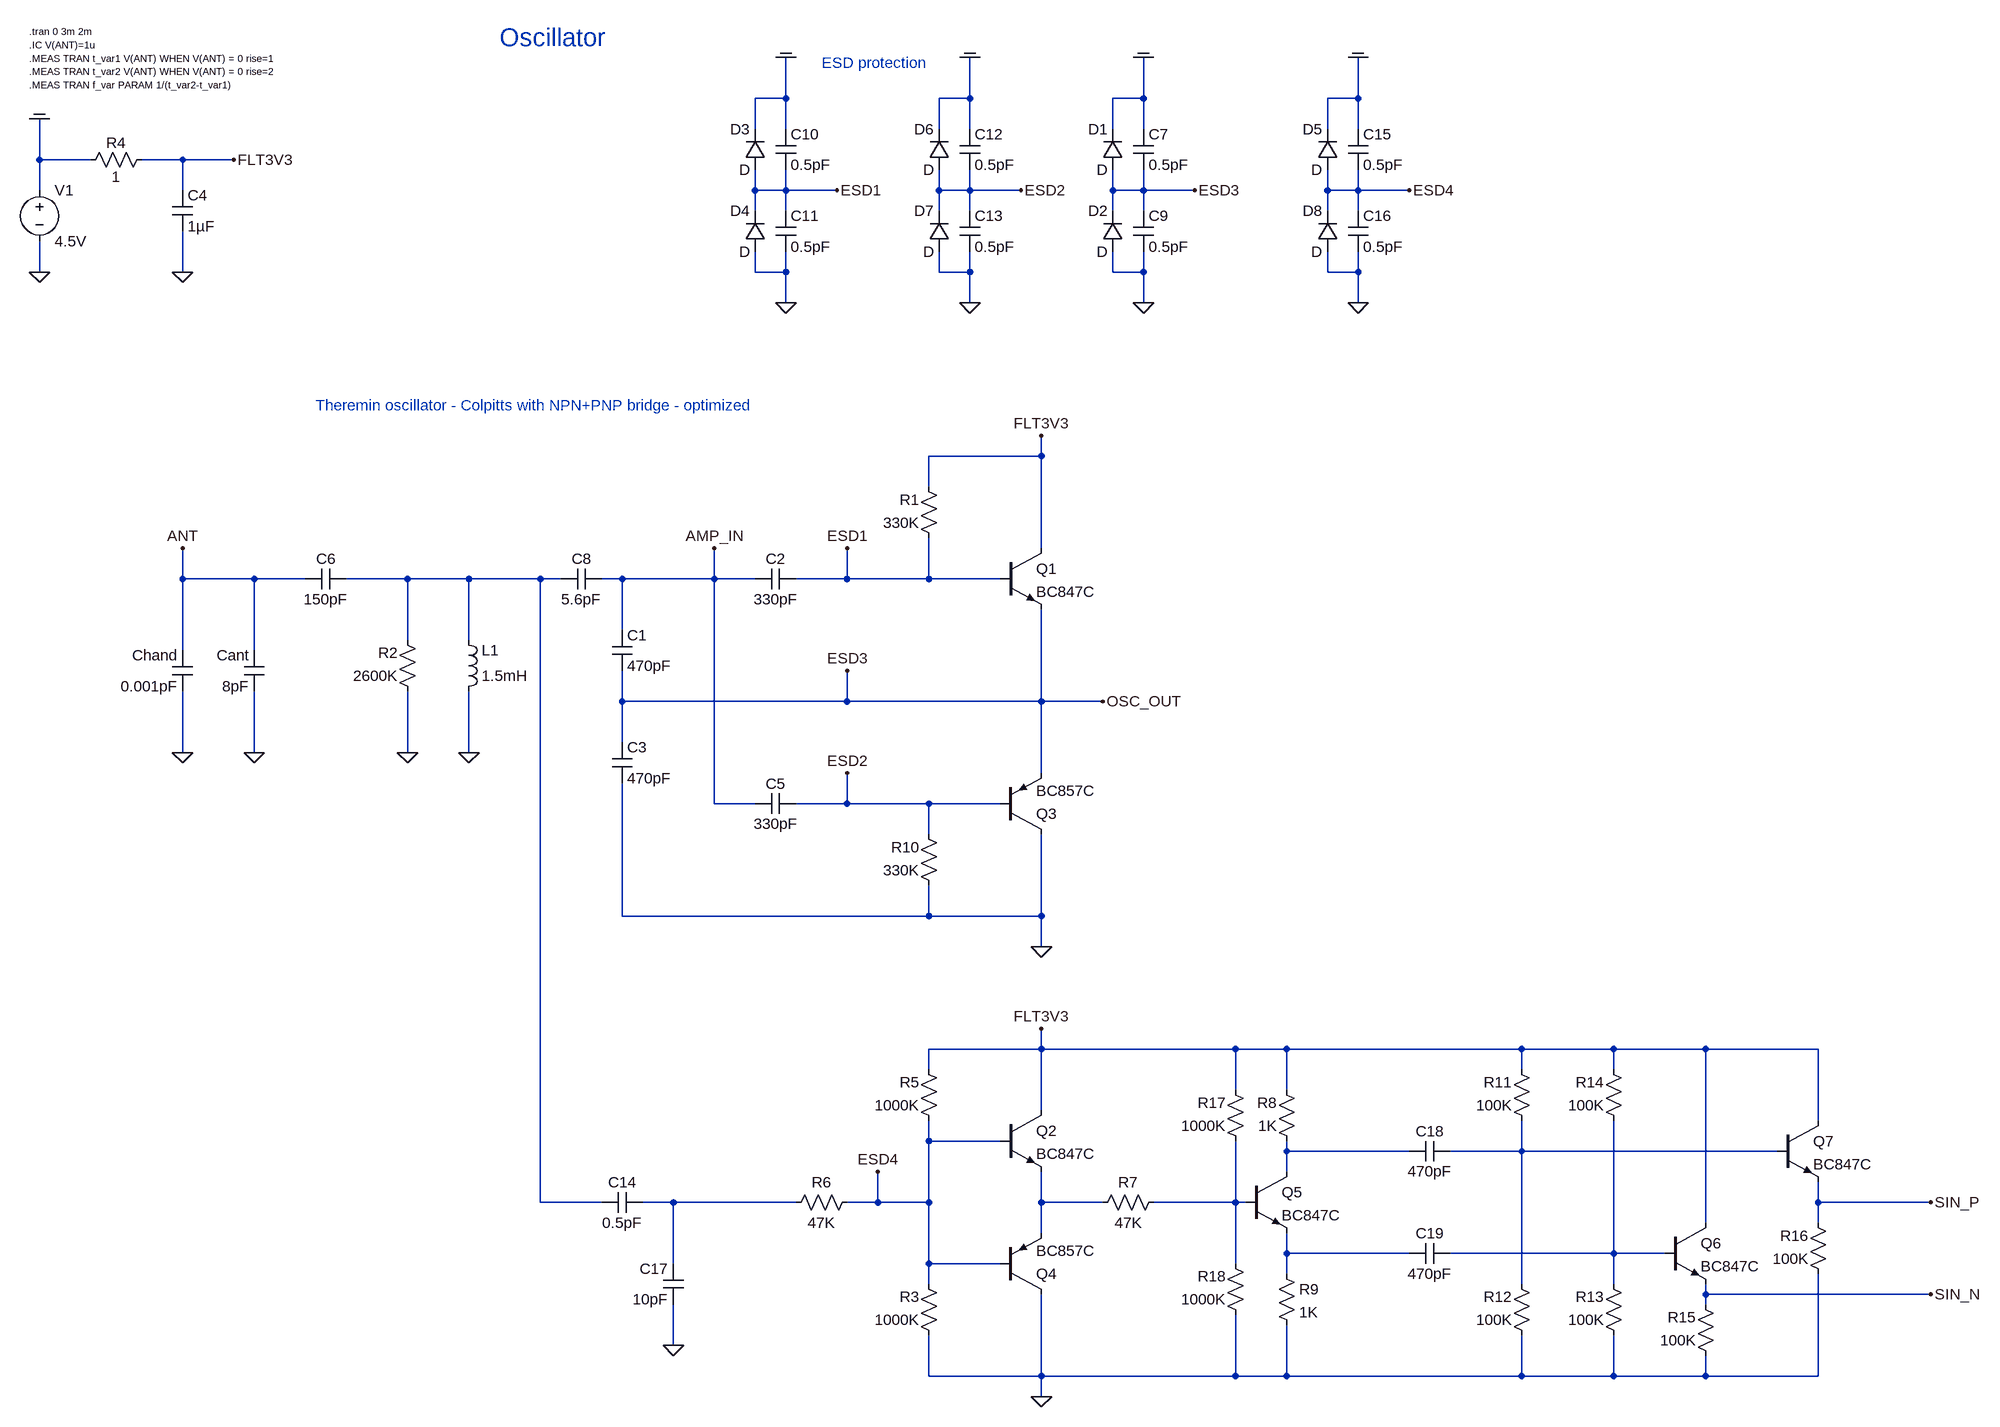
[diagram p0: schematic 2020_npn_pnp_advanced_osc_sine_out_v4.asc]
2020_npn_pnp_advanced_osc_sine_out_v4.asc, the LTspice schematic file:
Version 4
SHEET 1 2908 2724
WIRE 176 -96 176 -160
WIRE 176 -96 128 -96
WIRE 464 -96 464 -160
WIRE 464 -96 416 -96
WIRE 736 -96 736 -160
WIRE 736 -96 688 -96
WIRE 1072 -96 1072 -160
WIRE 1072 -96 1024 -96
WIRE 128 -48 128 -96
WIRE 176 -48 176 -96
WIRE 416 -48 416 -96
WIRE 464 -48 464 -96
WIRE 688 -48 688 -96
WIRE 736 -48 736 -96
WIRE 1024 -48 1024 -96
WIRE 1072 -48 1072 -96
WIRE -992 0 -992 -64
WIRE -912 0 -992 0
WIRE -768 0 -832 0
WIRE -688 0 -768 0
WIRE -992 48 -992 0
WIRE -768 48 -768 0
WIRE 128 48 128 16
WIRE 176 48 176 16
WIRE 176 48 128 48
WIRE 256 48 176 48
WIRE 416 48 416 16
WIRE 464 48 464 16
WIRE 464 48 416 48
WIRE 544 48 464 48
WIRE 688 48 688 16
WIRE 736 48 736 16
WIRE 736 48 688 48
WIRE 816 48 736 48
WIRE 1024 48 1024 16
WIRE 1072 48 1072 16
WIRE 1072 48 1024 48
WIRE 1152 48 1072 48
WIRE 128 80 128 48
WIRE 176 80 176 48
WIRE 416 80 416 48
WIRE 464 80 464 48
WIRE 688 80 688 48
WIRE 736 80 736 48
WIRE 1024 80 1024 48
WIRE 1072 80 1072 48
WIRE -992 176 -992 128
WIRE -768 176 -768 112
WIRE 128 176 128 144
WIRE 176 176 176 144
WIRE 176 176 128 176
WIRE 416 176 416 144
WIRE 464 176 464 144
WIRE 464 176 416 176
WIRE 688 176 688 144
WIRE 736 176 736 144
WIRE 736 176 688 176
WIRE 1024 176 1024 144
WIRE 1072 176 1072 144
WIRE 1072 176 1024 176
WIRE 176 224 176 176
WIRE 464 224 464 176
WIRE 736 224 736 176
WIRE 1072 224 1072 176
WIRE 576 464 576 432
WIRE 576 464 400 464
WIRE 400 512 400 464
WIRE 576 608 576 464
WIRE -768 656 -768 608
WIRE -656 656 -768 656
WIRE -576 656 -656 656
WIRE -416 656 -512 656
WIRE -320 656 -416 656
WIRE -208 656 -320 656
WIRE -176 656 -208 656
WIRE -80 656 -112 656
WIRE 64 656 64 608
WIRE 64 656 -80 656
WIRE 128 656 64 656
WIRE 272 656 272 608
WIRE 272 656 192 656
WIRE 400 656 400 592
WIRE 400 656 272 656
WIRE 512 656 400 656
WIRE -80 736 -80 656
WIRE -416 752 -416 656
WIRE -320 752 -320 656
WIRE -768 768 -768 656
WIRE -656 768 -656 656
WIRE -80 848 -80 800
WIRE 272 848 272 800
WIRE 272 848 -80 848
WIRE 576 848 576 704
WIRE 576 848 272 848
WIRE 672 848 576 848
WIRE -80 912 -80 848
WIRE -768 928 -768 832
WIRE -656 928 -656 832
WIRE -416 928 -416 832
WIRE -320 928 -320 832
WIRE 576 960 576 848
WIRE 64 1008 64 656
WIRE 128 1008 64 1008
WIRE 272 1008 272 960
WIRE 272 1008 192 1008
WIRE 400 1008 272 1008
WIRE 512 1008 400 1008
WIRE 400 1056 400 1008
WIRE -80 1184 -80 976
WIRE 400 1184 400 1136
WIRE 400 1184 -80 1184
WIRE 576 1184 576 1056
WIRE 576 1184 400 1184
WIRE 576 1232 576 1184
WIRE 576 1392 576 1360
WIRE 576 1392 400 1392
WIRE 880 1392 576 1392
WIRE 960 1392 880 1392
WIRE 1328 1392 960 1392
WIRE 1472 1392 1328 1392
WIRE 1616 1392 1472 1392
WIRE 1792 1392 1616 1392
WIRE 400 1424 400 1392
WIRE 1328 1424 1328 1392
WIRE 1472 1424 1472 1392
WIRE 880 1456 880 1392
WIRE 960 1456 960 1392
WIRE 576 1488 576 1392
WIRE 1792 1504 1792 1392
WIRE 400 1536 400 1504
WIRE 512 1536 400 1536
WIRE 960 1552 960 1536
WIRE 1152 1552 960 1552
WIRE 1328 1552 1328 1504
WIRE 1328 1552 1216 1552
WIRE 1728 1552 1328 1552
WIRE 960 1584 960 1552
WIRE -208 1632 -208 656
WIRE -112 1632 -208 1632
WIRE 0 1632 -48 1632
WIRE 192 1632 0 1632
WIRE 320 1632 320 1584
WIRE 320 1632 272 1632
WIRE 400 1632 400 1536
WIRE 400 1632 320 1632
WIRE 576 1632 576 1584
WIRE 672 1632 576 1632
WIRE 880 1632 880 1536
WIRE 880 1632 752 1632
WIRE 896 1632 880 1632
WIRE 1792 1632 1792 1600
WIRE 1968 1632 1792 1632
WIRE 1616 1664 1616 1392
WIRE 1792 1664 1792 1632
WIRE 576 1680 576 1632
WIRE 960 1712 960 1680
WIRE 1152 1712 960 1712
WIRE 1472 1712 1472 1504
WIRE 1472 1712 1216 1712
WIRE 1552 1712 1472 1712
WIRE 0 1728 0 1632
WIRE 400 1728 400 1632
WIRE 512 1728 400 1728
WIRE 880 1728 880 1632
WIRE 960 1744 960 1712
WIRE 400 1760 400 1728
WIRE 1328 1760 1328 1552
WIRE 1472 1760 1472 1712
WIRE 1616 1776 1616 1760
WIRE 1968 1776 1616 1776
WIRE 1616 1792 1616 1776
WIRE 0 1856 0 1792
WIRE 400 1904 400 1840
WIRE 576 1904 576 1776
WIRE 576 1904 400 1904
WIRE 880 1904 880 1808
WIRE 880 1904 576 1904
WIRE 960 1904 960 1824
WIRE 960 1904 880 1904
WIRE 1328 1904 1328 1840
WIRE 1328 1904 960 1904
WIRE 1472 1904 1472 1840
WIRE 1472 1904 1328 1904
WIRE 1616 1904 1616 1872
WIRE 1616 1904 1472 1904
WIRE 1792 1904 1792 1744
WIRE 1792 1904 1616 1904
WIRE 576 1936 576 1904
FLAG -992 176 0
FLAG -768 928 0
FLAG -768 608 ANT
FLAG -992 -64 COM
FLAG 176 224 0
FLAG 176 -160 COM
FLAG 256 48 ESD1
FLAG 464 224 0
FLAG 464 -160 COM
FLAG 544 48 ESD2
FLAG -656 928 0
FLAG 272 608 ESD1
FLAG -768 176 0
FLAG -416 928 0
FLAG -320 928 0
FLAG -688 0 FLT3V3
FLAG 576 432 FLT3V3
FLAG 672 848 OSC_OUT
FLAG 576 1232 0
FLAG 272 960 ESD2
FLAG 736 224 0
FLAG 736 -160 COM
FLAG 816 48 ESD3
FLAG 272 800 ESD3
FLAG 64 608 AMP_IN
FLAG 576 1360 FLT3V3
FLAG 576 1936 0
FLAG 1072 224 0
FLAG 1072 -160 COM
FLAG 1152 48 ESD4
FLAG 320 1584 ESD4
FLAG 0 1856 0
FLAG 1968 1632 SIN_P
FLAG 1968 1776 SIN_N
SYMBOL voltage -992 32 R0
WINDOW 123 0 0 Left 2
WINDOW 39 0 0 Left 2
SYMATTR InstName V1
SYMATTR Value 4.5V
SYMBOL ind -336 848 M180
WINDOW 0 36 80 Left 2
WINDOW 3 36 40 Left 2
SYMATTR InstName L1
SYMATTR Value 1.5mH
SYMATTR SpiceLine Ipk=0.1 Rser=32 Rpar=20Meg Cpar=1.286pF
SYMBOL cap -752 768 M0
SYMATTR InstName Chand
SYMATTR Value 0.001pF
SYMBOL diode 144 16 R180
WINDOW 0 24 64 Left 2
WINDOW 3 24 0 Left 2
SYMATTR InstName D3
SYMBOL diode 144 144 R180
WINDOW 0 24 64 Left 2
WINDOW 3 24 0 Left 2
SYMATTR InstName D4
SYMBOL cap 160 -48 R0
SYMATTR InstName C10
SYMATTR Value 0.5pF
SYMBOL cap 160 80 R0
SYMATTR InstName C11
SYMATTR Value 0.5pF
SYMBOL diode 432 16 R180
WINDOW 0 24 64 Left 2
WINDOW 3 24 0 Left 2
SYMATTR InstName D6
SYMBOL diode 432 144 R180
WINDOW 0 24 64 Left 2
WINDOW 3 24 0 Left 2
SYMATTR InstName D7
SYMBOL cap 448 -48 R0
SYMATTR InstName C12
SYMATTR Value 0.5pF
SYMBOL cap 448 80 R0
SYMATTR InstName C13
SYMATTR Value 0.5pF
SYMBOL cap -640 768 M0
SYMATTR InstName Cant
SYMATTR Value 8pF
SYMBOL res -816 -16 R90
WINDOW 0 5 56 VBottom 2
WINDOW 3 27 56 VTop 2
SYMATTR InstName R4
SYMATTR Value 1
SYMBOL cap -784 48 R0
SYMATTR InstName C4
SYMATTR Value 1µF
SYMBOL res 416 608 R180
WINDOW 0 31 76 Left 2
WINDOW 3 31 40 Left 2
SYMATTR InstName R1
SYMATTR Value 330K
SYMBOL res -400 848 R180
WINDOW 0 31 76 Left 2
WINDOW 3 31 40 Left 2
SYMATTR InstName R2
SYMATTR Value 2600K
SYMBOL cap -96 736 R0
SYMATTR InstName C1
SYMATTR Value 470pF
SYMBOL cap -96 912 R0
SYMATTR InstName C3
SYMATTR Value 470pF
SYMBOL npn 512 608 R0
SYMATTR InstName Q1
SYMATTR Value BC847C
SYMBOL cap -112 640 R90
WINDOW 0 0 32 VBottom 2
WINDOW 3 32 32 VTop 2
SYMATTR InstName C8
SYMATTR Value 5.6pF
SYMBOL pnp 512 1056 M180
SYMATTR InstName Q3
SYMATTR Value BC857C
SYMBOL res 416 1152 R180
WINDOW 0 31 76 Left 2
WINDOW 3 31 40 Left 2
SYMATTR InstName R10
SYMATTR Value 330K
SYMBOL cap 192 640 R90
WINDOW 0 0 32 VBottom 2
WINDOW 3 32 32 VTop 2
SYMATTR InstName C2
SYMATTR Value 330pF
SYMBOL cap 192 992 R90
WINDOW 0 0 32 VBottom 2
WINDOW 3 32 32 VTop 2
SYMATTR InstName C5
SYMATTR Value 330pF
SYMBOL cap -512 640 R90
WINDOW 0 0 32 VBottom 2
WINDOW 3 32 32 VTop 2
SYMATTR InstName C6
SYMATTR Value 150pF
SYMBOL diode 704 16 R180
WINDOW 0 24 64 Left 2
WINDOW 3 24 0 Left 2
SYMATTR InstName D1
SYMBOL diode 704 144 R180
WINDOW 0 24 64 Left 2
WINDOW 3 24 0 Left 2
SYMATTR InstName D2
SYMBOL cap 720 -48 R0
SYMATTR InstName C7
SYMATTR Value 0.5pF
SYMBOL cap 720 80 R0
SYMATTR InstName C9
SYMATTR Value 0.5pF
SYMBOL npn 512 1488 R0
SYMATTR InstName Q2
SYMATTR Value BC847C
SYMBOL pnp 512 1776 M180
SYMATTR InstName Q4
SYMATTR Value BC857C
SYMBOL res 416 1856 R180
WINDOW 0 31 76 Left 2
WINDOW 3 31 40 Left 2
SYMATTR InstName R3
SYMATTR Value 1000K
SYMBOL res 416 1520 R180
WINDOW 0 31 76 Left 2
WINDOW 3 31 40 Left 2
SYMATTR InstName R5
SYMATTR Value 1000K
SYMBOL cap -48 1616 R90
WINDOW 0 0 32 VBottom 2
WINDOW 3 32 32 VTop 2
SYMATTR InstName C14
SYMATTR Value 0.5pF
SYMBOL diode 1040 16 R180
WINDOW 0 24 64 Left 2
WINDOW 3 24 0 Left 2
SYMATTR InstName D5
SYMBOL diode 1040 144 R180
WINDOW 0 24 64 Left 2
WINDOW 3 24 0 Left 2
SYMATTR InstName D8
SYMBOL cap 1056 -48 R0
SYMATTR InstName C15
SYMATTR Value 0.5pF
SYMBOL cap 1056 80 R0
SYMATTR InstName C16
SYMATTR Value 0.5pF
SYMBOL res 176 1648 R270
WINDOW 0 32 56 VTop 2
WINDOW 3 0 56 VBottom 2
SYMATTR InstName R6
SYMATTR Value 47K
SYMBOL cap 16 1792 R180
WINDOW 0 24 56 Left 2
WINDOW 3 24 8 Left 2
SYMATTR InstName C17
SYMATTR Value 10pF
SYMBOL npn 896 1584 R0
SYMATTR InstName Q5
SYMATTR Value BC847C
SYMBOL res 976 1552 R180
WINDOW 0 31 76 Left 2
WINDOW 3 31 40 Left 2
SYMATTR InstName R8
SYMATTR Value 1K
SYMBOL res 944 1728 R0
SYMATTR InstName R9
SYMATTR Value 1K
SYMBOL res 896 1552 R180
WINDOW 0 31 76 Left 2
WINDOW 3 31 40 Left 2
SYMATTR InstName R17
SYMATTR Value 1000K
SYMBOL res 896 1824 R180
WINDOW 0 31 76 Left 2
WINDOW 3 31 40 Left 2
SYMATTR InstName R18
SYMATTR Value 1000K
SYMBOL res 656 1648 R270
WINDOW 0 32 56 VTop 2
WINDOW 3 0 56 VBottom 2
SYMATTR InstName R7
SYMATTR Value 47K
SYMBOL cap 1216 1536 R90
WINDOW 0 0 32 VBottom 2
WINDOW 3 32 32 VTop 2
SYMATTR InstName C18
SYMATTR Value 470pF
SYMBOL cap 1216 1696 R90
WINDOW 0 0 32 VBottom 2
WINDOW 3 32 32 VTop 2
SYMATTR InstName C19
SYMATTR Value 470pF
SYMBOL res 1344 1520 R180
WINDOW 0 31 76 Left 2
WINDOW 3 31 40 Left 2
SYMATTR InstName R11
SYMATTR Value 100K
SYMBOL res 1344 1856 R180
WINDOW 0 31 76 Left 2
WINDOW 3 31 40 Left 2
SYMATTR InstName R12
SYMATTR Value 100K
SYMBOL res 1488 1856 R180
WINDOW 0 31 76 Left 2
WINDOW 3 31 40 Left 2
SYMATTR InstName R13
SYMATTR Value 100K
SYMBOL res 1488 1520 R180
WINDOW 0 31 76 Left 2
WINDOW 3 31 40 Left 2
SYMATTR InstName R14
SYMATTR Value 100K
SYMBOL npn 1552 1664 R0
SYMATTR InstName Q6
SYMATTR Value BC847C
SYMBOL npn 1728 1504 R0
SYMATTR InstName Q7
SYMATTR Value BC847C
SYMBOL res 1632 1888 R180
WINDOW 0 31 76 Left 2
WINDOW 3 31 40 Left 2
SYMATTR InstName R15
SYMATTR Value 100K
SYMBOL res 1808 1760 R180
WINDOW 0 31 76 Left 2
WINDOW 3 31 40 Left 2
SYMATTR InstName R16
SYMATTR Value 100K
TEXT -1008 -200 Left 1 !.tran 0 3m 2m\n.IC V(ANT)=1u\n.MEAS TRAN t_var1 V(ANT) WHEN V(ANT) = 0 rise=1\n.MEAS TRAN t_var2 V(ANT) WHEN V(ANT) = 0 rise=2\n.MEAS TRAN f_var PARAM 1/(t_var2-t_var1)
TEXT 232 -152 Left 2 ;ESD protection
TEXT -272 -192 Left 4 ;Oscillator
TEXT -560 384 Left 2 ;Theremin oscillator - Colpitts with NPN+PNP bridge - optimized

The netlist it stands for:
* 2020_npn_pnp_advanced_osc_sine_out_v4.asc
V1 COM 0 4.5V
L1 0 N001 1.5mH Ipk=0.1 Rser=32 Rpar=20Meg Cpar=1.286pF
Chand ANT 0 0.001pF
D3 ESD1 COM D
D4 0 ESD1 D
C10 COM ESD1 0.5pF
C11 ESD1 0 0.5pF
D6 ESD2 COM D
D7 0 ESD2 D
C12 COM ESD2 0.5pF
C13 ESD2 0 0.5pF
Cant ANT 0 8pF
R4 FLT3V3 COM 1
C4 FLT3V3 0 1µF
R1 ESD1 FLT3V3 330K
R2 0 N001 2600K
C1 AMP_IN ESD3 470pF
C3 ESD3 0 470pF
Q1 FLT3V3 ESD1 ESD3 0 BC847C
C8 AMP_IN N001 5.6pF
Q3 0 ESD2 ESD3 0 BC857C
R10 0 ESD2 330K
C2 ESD1 AMP_IN 330pF
C5 ESD2 AMP_IN 330pF
C6 N001 ANT 150pF
D1 ESD3 COM D
D2 0 ESD3 D
C7 COM ESD3 0.5pF
C9 ESD3 0 0.5pF
Q2 FLT3V3 ESD4 N005 0 BC847C
Q4 0 ESD4 N005 0 BC857C
R3 0 ESD4 1000K
R5 ESD4 FLT3V3 1000K
C14 N004 N001 0.5pF
D5 ESD4 COM D
D8 0 ESD4 D
C15 COM ESD4 0.5pF
C16 ESD4 0 0.5pF
R6 N004 ESD4 47K
C17 0 N004 10pF
Q5 N002 N006 N007 0 BC847C
R8 N002 FLT3V3 1K
R9 N007 0 1K
R17 N006 FLT3V3 1000K
R18 0 N006 1000K
R7 N005 N006 47K
C18 N003 N002 470pF
C19 N008 N007 470pF
R11 N003 FLT3V3 100K
R12 0 N003 100K
R13 0 N008 100K
R14 N008 FLT3V3 100K
Q6 FLT3V3 N008 SIN_N 0 BC847C
Q7 FLT3V3 N003 SIN_P 0 BC847C
R15 0 SIN_N 100K
R16 0 SIN_P 100K
.model D D
.lib standard.dio
.model NPN NPN
.model PNP PNP
.lib standard.bjt
.tran 0 3m 2m
.IC V(ANT)=1u
.MEAS TRAN t_var1 V(ANT) WHEN V(ANT) = 0 rise=1
.MEAS TRAN t_var2 V(ANT) WHEN V(ANT) = 0 rise=2
.MEAS TRAN f_var PARAM 1/(t_var2-t_var1)
* ESD protection
* Oscillator
* Theremin oscillator - Colpitts with NPN+PNP bridge - optimized
.backanno
.end